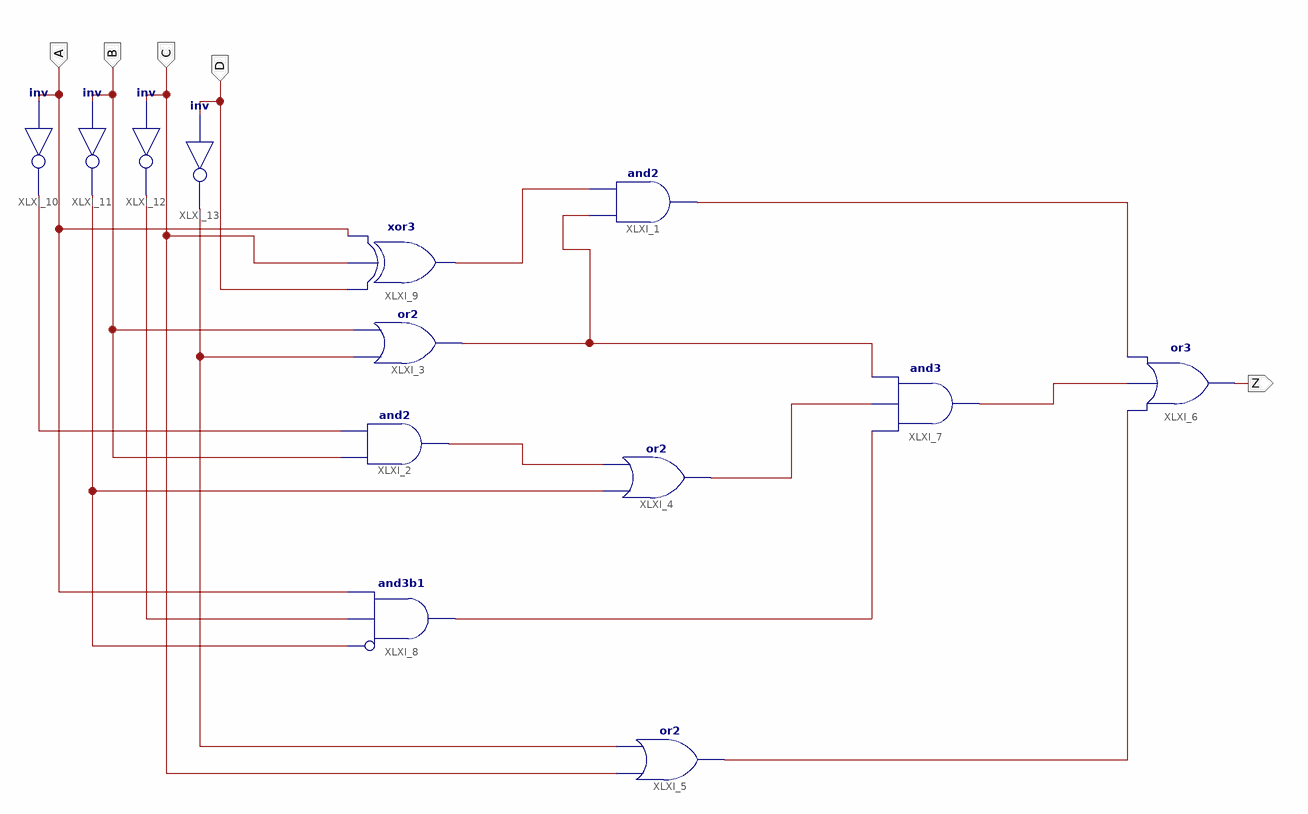
[diagram p0: schematic sheet 1]
// Xilinx ISE schematic p1ej3a.sch (spartan3) as structural Verilog: 13 symbols, 5 ports
module p1ej3a (
  input  B,
  input  C,
  input  D,
  input  A,
  output Z
);

  wire XLXN_9, XLXN_11, XLXN_12, XLXN_15, XLXN_19, XLXN_21, XLXN_22, XLXN_23, XLXN_25, XLXN_26, XLXN_27,
       XLXN_28;

  and XLXI_1 (XLXN_26, XLXN_25, XLXN_19);
  and XLXI_2 (XLXN_23, B, XLXN_15);
  or XLXI_3 (XLXN_25, XLXN_9, B);
  or XLXI_4 (XLXN_21, XLXN_11, XLXN_23);
  or XLXI_5 (XLXN_28, C, XLXN_9);
  or XLXI_6 (Z, XLXN_28, XLXN_27, XLXN_26);
  and XLXI_7 (XLXN_27, XLXN_22, XLXN_21, XLXN_25);
  and XLXI_8 (XLXN_22, ~XLXN_11, XLXN_12, A);  // and3b1
  xor XLXI_9 (XLXN_19, D, C, A);
  not XLXI_10 (XLXN_15, A);
  not XLXI_11 (XLXN_11, B);
  not XLXI_12 (XLXN_12, C);
  not XLXI_13 (XLXN_9, D);
endmodule
